# Altium project ECE453-Base.PrjPcb
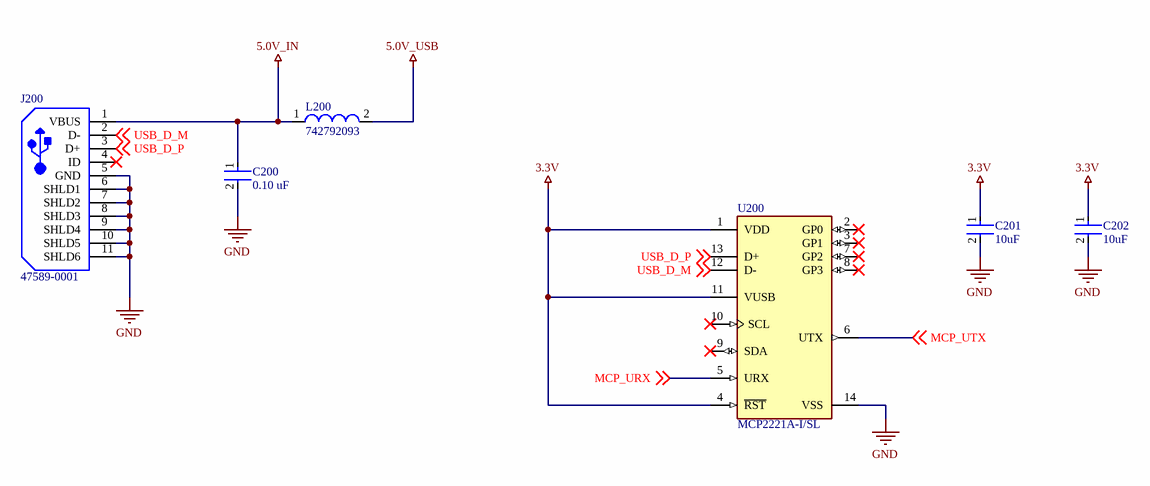
[diagram p0: 02_USB_Bridge.SchDoc]
5 sheets, 59 parts. Net scope: global (net labels, ports and power ports of the same name join across sheets).
Board file: ECE453.PcbDoc
Sheets:
  02_USB_Bridge.SchDoc
  03_Connectors.SchDoc
  05_Mechanical.SchDoc
  07_Programming_Reset.SchDoc
  08_User_IO.SchDoc

## Sheet 02_USB_Bridge.SchDoc: USB Bridge
size A; Revision: A; SheetNumber: 2; SheetTotal: 8; ECE315_Project_Name: ECE453 MCU Base Project

### Parts
C200  0.10 uF  [FP-C0805C-DN-MFG]
C201  10uF  [FP-C0805C-DG-MFG]
C202  10uF  [FP-C0805C-DG-MFG]
J200  47589-0001  [MOLX-47589-0001_V]
L200  742792093  [SMD-0805]
U200  MCP2221A-I/SL  [FP-C04-065-SL-MFG]

### Nets
3.3V: C201.1 C202.1 U200.1(VDD) U200.4(~{RST}) U200.11(VUSB)
5.0V_IN: C200.1 J200.1(VBUS) L200.1
5.0V_USB: L200.2
GND: C200.2 C201.2 C202.2 J200.5(GND) J200.6(SHLD1) J200.7(SHLD2) J200.8(SHLD3) J200.9(SHLD4) J200.10(SHLD5) J200.11(SHLD6) U200.14(VSS)
MCP_URX: U200.5(URX) ; off-sheet MCP_URX
MCP_UTX: U200.6(UTX) ; off-sheet MCP_UTX
USB_D_M: J200.2(D-) U200.12(D-) ; off-sheet USB_D_M
USB_D_P: J200.3(D+) U200.13(D+) ; off-sheet USB_D_P

Not connected (* = marked no-connect by the designer): J200 4(ID)*; U200 2(GP0)* 3(GP1)* 7(GP2)* 8(GP3)* 9(SDA)* 10(SCL)*

### Notes on the sheet
- Title:
- Size:
- A
- Project
- Rev:
- Sheet:
- of
- College of Engineering
- 1415 Engineering Drive
- Madison, WI 53706

### Library data of the parts
C200 = CMP-2007-00279-2: CAP CER 0.1UF 50V X7R 0805; Manufacturer Part Number: C0805C104K5RACTU; Manufacturer: KEMET; Value: 0.10 μF; Tolerance: 0.1; Temperature Coefficient: 30ppm/°C; Material: Ceramic; Device Class L2: Capacitors; Temperature Range Low: -55°C; Voltage Rating: 50 V; Digikey Description: CAP CER 0.1UF 50V X7R 0805; Category: Cap; ComponentLink2Description: Datasheet; Octopart: https://octopart.com/c0805c104k5ractu-kemet-143926; RoHS: TRUE; ComponentLink2URL: https://content.kemet.com/datasheets/KEM_C1003_C0G_SMD.pdf; Temperature Characteristic: X7R; Temperature: -55°C to +125°C; Height: 0.88mm; Temperature Range High: +125°C; Device Class L1: Passive Components; Automotive: No; Lead Free: Yes; Ipc Land Pattern Name: CAPC200125X78; Device Class L3: Ceramic Capacitors; Mouser Description: Cap Ceramic 0.1uF 50V X7R 10% SMD 2.0 x 1.2 mm 125 C Paper T/R; Capacitance: 0.10 μF; Package: C0805C-DN
C201 C202 = CMP-2007-03243-2: CAP CER 10UF 10V X5R 0805; Manufacturer Part Number: C0805C106K8PACTU; Manufacturer: Kemet; 3DS Part Number: 220-00001; Tolerance: 10%; Temperature Coefficient: 15%; Material: Ceramic; Device Class L2: Capacitors; Device Class L1: Passive Components; ComponentLink2URL: https://content.kemet.com/datasheets/KEM_C1006_X5R_SMD.pdf; Height: 1.4mm; Lead Free: Yes; Digikey Description: CAP CER 10UF 10V X5R 0805; Octopart: https://octopart.com/c0805c106k8pactu-kemet-98697; Capacitance: 10uF; Value: 10uF; Temperature Range Low: -55°C; Temperature: -55°C to +85°C; Automotive: No; Mouser Description: CAP CER 10UF 10V X5R 0805; Ipc Land Pattern Name: CAPC200125X125; Temperature Range High: +85°C; Voltage: 10V; RoHS: TRUE; Device Class L3: Ceramic Capacitors; ComponentLink2Description: Datasheet; Voltage Rating: 10V; Package: C0805C-DG; Temperature Characteristic: X5R; Category: Cap
J200 = CMP-2000-05610-1: Right Angle Female Type AB Micro USB Connector, 30 V, 1.8 A, -30 to 85 degC, RoHS, Tape and Reel; Number of Ports: 1Port; Current Rating: 1.8A; Brand: Molex; Connector Type: MicroUSBTypeABreceptacle; Number of Contacts: 5Contact; Voltage Rating: 30VAC; Color: Black; Product: MicroUSBTypeABConnectors; Package URL: http://www.molex.com/pdm_docs/sd/475890001_sd.pdf; Contact Plating: Gold; Datasheet URL: http://www.molex.com/webdocs/datasheets/pdf/en-us/0475890001_IO_CONNECTORS.pdf; Operating Temperature Range: -20Cto+85C; Termination Style: SMD/SMT; Mounting Angle: Right; Package Reference: 47589-0001; Gender: Female; Package Description: Micro USB Connector, Pitch 0.65 mm, 5 Positions, Body 7.5 x 5.6 mm; Mounting Technology: SurfaceMount; Contact Material: CopperAlloy; Packaging: Reel; RoHS: True; Standard: USB; Manufacturer URL: http://www.molex.com/; Manufacturer: Molex; Datasheet Version: 12/2016; Product Category: USBConnectors; Series: 47589
L200 = CMP-0220-00169-1: SMD EMI Suppression Ferrite Bead WE-CBF, Z = 2200 Ohm; DatasheetVersion: Dec-2005; ComponentLink2URL: http://www.we-online.de/katalog/media/pdf/742792093.pdf; PackageDescription: Chip Inductor, 2-Leads, Body 2.0 x 1.2 mm; Impedance: 2200 Ohm; ComponentLink2Description: Datasheet; ComponentLink1Description: Manufacturer Link; PackageReference: SMD-0805; ComponentLink1URL: http://www.we-online.com; PackageVersion: 2005
U200 = CMP-06284-000011-1: IC USB TO I2C/UART 14SOIC; Manufacturer: Microchip; Min Supply Voltage: 3V; Usb Standard: USB 2.0; Max Supply Voltage: 5.5V; Nominal Supply Current: 10-13mA; Automotive Grade: Grade 3; Interface: I2C,UART,USB; Standoff Height: 0.1mm; Max Junction Temp: +150°C; Data Rate: 12Mbits/s; Lead Free: Yes; Height: 1.75mm; Octopart: https://octopart.com/mcp2221a-i%2Fsl-microchip-71704986; Package: C04-065-SL; Digikey Description: IC USB TO I2C/UART 14SOIC; Temperature Range Low: -40°C; Temperature: -40°C to +85°C; Category: IC; Temperature Range High: +85°C; Ambient Temperature Range Low: -40°C; Device Class L1: Integrated Circuits (ICs); Footprint Url: http://ww1.microchip.com/downloads/en/DeviceDoc/14L%20SOIC%203_90%20mm%20%28SL%29%20C04-00065d.pdf; Automotive: Yes; ComponentLink2URL: http://ww1.microchip.com/downloads/en/DeviceDoc/20005565B.pdf; Ambient Temperature Range High: +85°C; RoHS: TRUE; Device Class L3: USB Interface ICs; ComponentLink2Description: Datasheet; Device Class L2: Interface ICs; Manufacturer Part Number: MCP2221A-I/SL; Ipc Land Pattern Name: SOIC127P600X175-14

## Sheet 03_Connectors.SchDoc: Off Board Connectors
size A; Revision: A; SheetNumber: 3; SheetTotal: 8; ECE315_Project_Name: ECE453 MCU Base Project
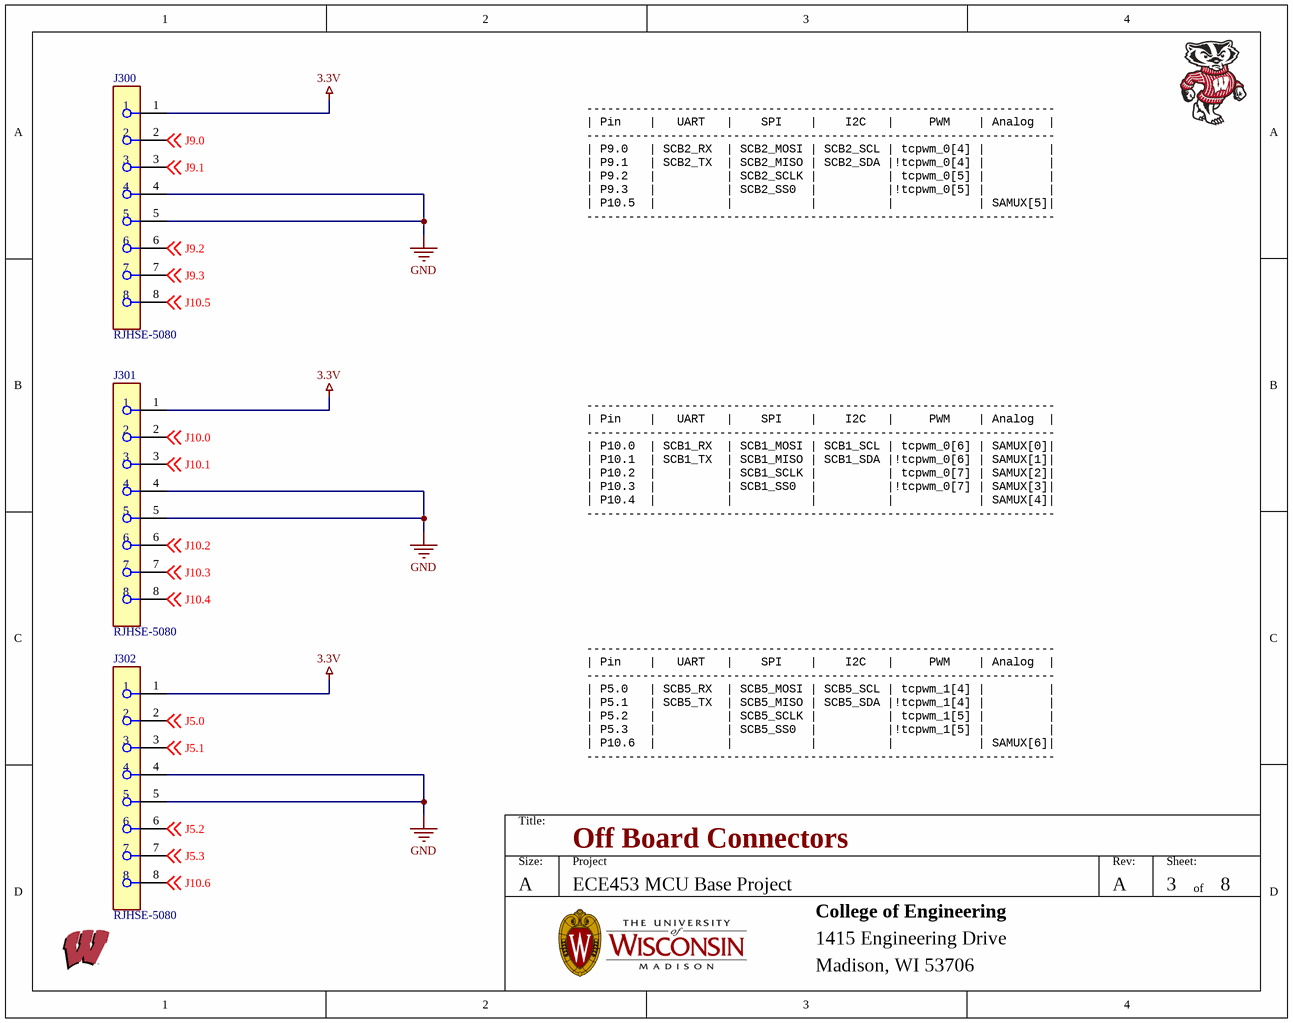
[diagram p1: 03_Connectors.SchDoc]

### Parts
J300  RJHSE-5080  [FP-RJHSE-5080-MFG]
J301  RJHSE-5080  [FP-RJHSE-5080-MFG]
J302  RJHSE-5080  [FP-RJHSE-5080-MFG]

### Nets
3.3V: J300.1 J301.1 J302.1
GND: J300.4 J300.5 J301.4 J301.5 J302.4 J302.5
J5.0: J302.2 ; off-sheet J5.0
J5.1: J302.3 ; off-sheet J5.1
J5.2: J302.6 ; off-sheet J5.2
J5.3: J302.7 ; off-sheet J5.3
J9.0: J300.2 ; off-sheet J9.0
J9.1: J300.3 ; off-sheet J9.1
J9.2: J300.6 ; off-sheet J9.2
J9.3: J300.7 ; off-sheet J9.3
J10.0: J301.2 ; off-sheet J10.0
J10.1: J301.3 ; off-sheet J10.1
J10.2: J301.6 ; off-sheet J10.2
J10.3: J301.7 ; off-sheet J10.3
J10.4: J301.8 ; off-sheet J10.4
J10.5: J300.8 ; off-sheet J10.5
J10.6: J302.8 ; off-sheet J10.6

### Notes on the sheet
- -------------------------------------------------------------------
  | Pin    |   UART   |    SPI    |    I2C   |     PWM    | Analog  |
  -------------------------------------------------------------------
  | P9.0   | SCB2_RX  | SCB2_MOSI | SCB2_SCL | tcpwm_0[4] |         |
  | P9.1   | SCB2_TX  | SCB2_MISO | SCB2_SDA |!tcpwm_0[4] |         |
  | P9.2   |          | SCB2_SCLK |          | tcpwm_0[5] |         |
  | P9.3   |          | SCB2_SS0  |          |!tcpwm_0[5] |         |
  | P10.5  |          |           |          |            | SAMUX[5]|
  -------------------------------------------------------------------
- -------------------------------------------------------------------
  | Pin    |   UART   |    SPI    |    I2C   |     PWM    | Analog  |
  -------------------------------------------------------------------
  | P10.0  | SCB1_RX  | SCB1_MOSI | SCB1_SCL | tcpwm_0[6] | SAMUX[0]|
  | P10.1  | SCB1_TX  | SCB1_MISO | SCB1_SDA |!tcpwm_0[6] | SAMUX[1]|
  | P10.2  |          | SCB1_SCLK |          | tcpwm_0[7] | SAMUX[2]|
  | P10.3  |          | SCB1_SS0  |          |!tcpwm_0[7] | SAMUX[3]|
  | P10.4  |          |           |          |            | SAMUX[4]|
  -------------------------------------------------------------------
- -------------------------------------------------------------------
  | Pin    |   UART   |    SPI    |    I2C   |     PWM    | Analog  |
  -------------------------------------------------------------------
  | P5.0   | SCB5_RX  | SCB5_MOSI | SCB5_SCL | tcpwm_1[4] |         |
  | P5.1   | SCB5_TX  | SCB5_MISO | SCB5_SDA |!tcpwm_1[4] |         |
  | P5.2   |          | SCB5_SCLK |          | tcpwm_1[5] |         |
  | P5.3   |          | SCB5_SS0  |          |!tcpwm_1[5] |         |
  | P10.6  |          |           |          |            | SAMUX[6]|
  -------------------------------------------------------------------
- Title:
- Size:
- A
- Project
- Rev:
- Sheet:
- of
- College of Engineering
- 1415 Engineering Drive
- Madison, WI 53706

### Library data of the parts
J300-J302 = CMP-02366-000003-1: CONN MOD JACK 8P8C R/A UNSHLD; Manufacturer: Amphenol; Current Rating: 1.5A; Voltage Rating: 125V; Pitch: 1.02mm; Conn Orientation: Right Angle; Number Of Contacts: 8; Is Female: yes; Conn Gender: Female; Contact Resistance: 20mR; Number of Ports: 1; Connector Type: RJ45; Lead Free: Yes; Device Class L3: unset; Footprint Url: https://cdn.amphenol-icc.com/media/wysiwyg/files/drawing/rjhse5080.pdf?__cf_chl_jschl_tk__=e349db0bbbb6188a39347cd5e541b92fa02c9719-1587748343-0-AW7tChdeHzRPLX9gSWj7WrKaXQoY9BsmT9Ek0h-T62M9y3Rs9iypFcOtkzb-6sGYQEjFE-jcoNciDETCOZrh1rYyOesac5SvYLoLwHIsHvF4AKBlx-MXmfZUVk9OTTJLqyQq2qMm0PFRLJpNcK0nrKResqOniRSYixG2sPTmOPraH-ULJFBDL602CHqcI9KKBgTq90Jh1OL2Td4moJ99rFsJRJ1Tk_uoxGe8ublcP_ARu-uLpWcQrBcwOcHDTAwL29DAwVaqcH7ta8Ks7WMlHmVl_pILeEDwT0bE9vu5Pa5S3PtNRF1leuFkgi_FMbUxTDulc5xzbXSfng8srUIV1lWXny5nx1fZJEUa_w97yKjffzBMxiWLWVN-V7-uqAaPbyv_m-wRyw5O25OZNyJOeGU; ComponentLink2URL: https://cdn.amphenol-icc.com/media/wysiwyg/files/documentation/datasheet/inputoutput/io-modjack-rjhse.pdf; Device Class L1: Connectors; Package: CONN_MOD_JACK; Mouser Description: Modular Connectors / Ethernet Connectors R/A RJ45 NONSHIELDED 8 CONT NO LEDS; Manufacturer Part Number: RJHSE-5080; Octopart: https://octopart.com/rjhse-5080-amphenol-45060; Category: Conn; Height: 0.535inch; Temperature: -55°C to +85°C; Digikey Description: CONN MOD JACK 8P8C R/A UNSHLD; Device Class L2: Modular / Ethernet Connectors; Contact Material: Gold,Nickel; ComponentLink2Description: Datasheet; Temperature Range Low: -55°C; RoHS: TRUE; Automotive: No; Temperature Range High: +85°C; Supplier: Digikey; Supplier Part Number: RJHSE-5080-ND; Stock: 72112; Pricing: 1=1.03, 10=0.867, 25=0.832, 50=0.8142, 100=0.7788, 250=0.708, 500=0.6372, 1000=0.56641, 2500=0.51331 (USD); Mounting Technology: Through Hole,Panel; Contact Plating: Gold; Max Current Rating: 1.5A; Number of Positions Loaded: 8; Max Voltage Rating (AC): 125V; Orientation: Right Angle; Packaging: Rail/Tube; Gender: Female; Termination: Solder; Number of Positions: 8; Voltage Rating (DC): 125V; Length: 15.75mm; Depth: 14.99mm; Radiation Hardening: No; RoHS Compliant: Yes; Reach SVHC Compliant: Unknown; ComponentLink1URL: https://datasheet.ciiva.com/7629/1682821-7629402.pdf?src-supplier=Element14; ComponentLink1Description: https://datasheet.ciiva.com/7629/1682821-7629402.pdf?src-supplier=Element14; ComponentLink3URL: https://datasheet.ciiva.com/1432/1693748-1432448.pdf?src-supplier=Element14; ComponentLink3Description: https://datasheet.ciiva.com/1432/1693748-1432448.pdf?src-supplier=Element14

## Sheet 05_Mechanical.SchDoc: Mechanicals
size A; Revision: A; SheetNumber: 5; SheetTotal: 8; ECE315_Project_Name: ECE453 MCU Base Project
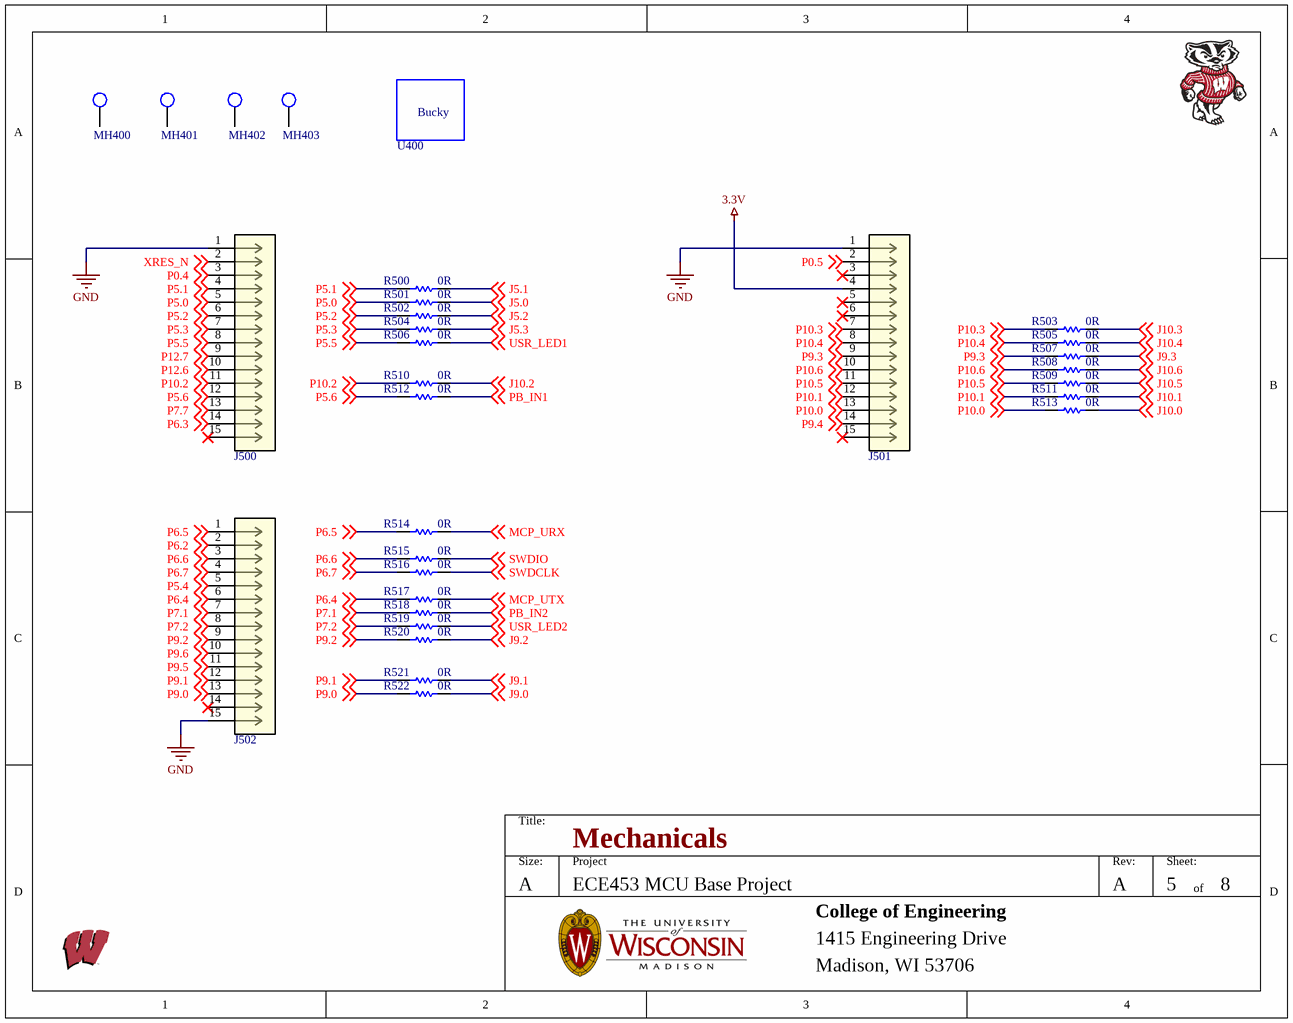
[diagram p2: 05_Mechanical.SchDoc]

### Parts
J500  68000-115HLF  [CONN_15POS_2P54MM]  (value not drawn)
J501  68000-115HLF  [CONN_15POS_2P54MM]  (value not drawn)
J502  68000-115HLF  [CONN_15POS_2P54MM]  (value not drawn)
MH400  MHOLE_2_55MM  [MHOLE_2_55MM]  (value not drawn)
MH401  MHOLE_2_55MM  [MHOLE_2_55MM]  (value not drawn)
MH402  MHOLE_2_55MM  [MHOLE_2_55MM]  (value not drawn)
MH403  MHOLE_2_55MM  [MHOLE_2_55MM]  (value not drawn)
R500  0R  [RESC2013X70X40NL20T20]
R501  0R  [RESC2013X70X40NL20T20]
R502  0R  [RESC2013X70X40NL20T20]
R503  0R  [RESC2013X70X40NL20T20]
R504  0R  [RESC2013X70X40NL20T20]
R505  0R  [RESC2013X70X40NL20T20]
R506  0R  [RESC2013X70X40NL20T20]
R507  0R  [RESC2013X70X40NL20T20]
R508  0R  [RESC2013X70X40NL20T20]
R509  0R  [RESC2013X70X40NL20T20]
R510  0R  [RESC2013X70X40NL20T20]
R511  0R  [RESC2013X70X40NL20T20]
R512  0R  [RESC2013X70X40NL20T20]
R513  0R  [RESC2013X70X40NL20T20]
R514  0R  [RESC2013X70X40NL20T20]
R515  0R  [RESC2013X70X40NL20T20]
R516  0R  [RESC2013X70X40NL20T20]
R517  0R  [RESC2013X70X40NL20T20]
R518  0R  [RESC2013X70X40NL20T20]
R519  0R  [RESC2013X70X40NL20T20]
R520  0R  [RESC2013X70X40NL20T20]
R521  0R  [RESC2013X70X40NL20T20]
R522  0R  [RESC2013X70X40NL20T20]
U400  Bucky  [WalkingBucky]  (value not drawn)  (no BOM)

### Nets
3.3V: J501.4
GND: J500.1 J501.1 J502.15
J5.0: R501.2 ; off-sheet J5.0
J5.1: R500.2 ; off-sheet J5.1
J5.2: R502.2 ; off-sheet J5.2
J5.3: R504.2 ; off-sheet J5.3
J9.0: R522.2 ; off-sheet J9.0
J9.1: R521.2 ; off-sheet J9.1
J9.2: R520.2 ; off-sheet J9.2
J9.3: R507.2 ; off-sheet J9.3
J10.0: R513.2 ; off-sheet J10.0
J10.1: R511.2 ; off-sheet J10.1
J10.2: R510.2 ; off-sheet J10.2
J10.3: R503.2 ; off-sheet J10.3
J10.4: R505.2 ; off-sheet J10.4
J10.5: R509.2 ; off-sheet J10.5
J10.6: R508.2 ; off-sheet J10.6
MCP_URX: R514.2 ; off-sheet MCP_URX
MCP_UTX: R517.2 ; off-sheet MCP_UTX
P0.4: J500.3 ; off-sheet P0.4
P0.5: J501.2 ; off-sheet P0.5
P5.0: J500.5 R501.1 ; off-sheet P5.0
P5.1: J500.4 R500.1 ; off-sheet P5.1
P5.2: J500.6 R502.1 ; off-sheet P5.2
P5.3: J500.7 R504.1 ; off-sheet P5.3
P5.4: J502.5 ; off-sheet P5.4
P5.5: J500.8 R506.1 ; off-sheet P5.5
P5.6: J500.12 R512.1 ; off-sheet P5.6
P6.2: J502.2 ; off-sheet P6.2
P6.3: J500.14 ; off-sheet P6.3
P6.4: J502.6 R517.1 ; off-sheet P6.4
P6.5: J502.1 R514.1 ; off-sheet P6.5
P6.6: J502.3 R515.1 ; off-sheet P6.6
P6.7: J502.4 R516.1 ; off-sheet P6.7
P7.1: J502.7 R518.1 ; off-sheet P7.1
P7.2: J502.8 R519.1 ; off-sheet P7.2
P7.7: J500.13 ; off-sheet P7.7
P9.0: J502.13 R522.1 ; off-sheet P9.0
P9.1: J502.12 R521.1 ; off-sheet P9.1
P9.2: J502.9 R520.1 ; off-sheet P9.2
P9.3: J501.9 R507.1 ; off-sheet P9.3
P9.4: J501.14 ; off-sheet P9.4
P9.5: J502.11 ; off-sheet P9.5
P9.6: J502.10 ; off-sheet P9.6
P10.0: J501.13 R513.1 ; off-sheet P10.0
P10.1: J501.12 R511.1 ; off-sheet P10.1
P10.2: J500.11 R510.1 ; off-sheet P10.2
P10.3: J501.7 R503.1 ; off-sheet P10.3
P10.4: J501.8 R505.1 ; off-sheet P10.4
P10.5: J501.11 R509.1 ; off-sheet P10.5
P10.6: J501.10 R508.1 ; off-sheet P10.6
P12.6: J500.10 ; off-sheet P12.6
P12.7: J500.9 ; off-sheet P12.7
PB_IN1: R512.2 ; off-sheet PB_IN1
PB_IN2: R518.2 ; off-sheet PB_IN2
SWDCLK: R516.2 ; off-sheet SWDCLK
SWDIO: R515.2 ; off-sheet SWDIO
USR_LED1: R506.2 ; off-sheet USR_LED1
USR_LED2: R519.2 ; off-sheet USR_LED2
XRES_N: J500.2 ; off-sheet XRES_N

Not connected (* = marked no-connect by the designer): J500 15*; J501 3* 5* 6* 15*; J502 14*; MH400 1; MH401 1; MH402 1; MH403 1

### Notes on the sheet
- Title:
- Size:
- A
- Project
- Rev:
- Sheet:
- of
- College of Engineering
- 1415 Engineering Drive
- Madison, WI 53706

### Library data of the parts
J500-J502 = CONN_HEADER_POS_30_2.54MM: Conn Unshrouded Header HDR 15 POS 2.54mm Solder ST Thru-Hole; Mfr_Name: Amphenol ICC; Manufacturer: Adam Equipment; Manufacturer Part Number: PH1-15-UA; Copyright: Copyright (C) 2024 Ultra Librarian. All rights reserved.; Manufacturer_Part_Number: 68000-115HLF; RefDes: RefDes; Type: DEV; Supplier: Digikey; Supplier Part Number: 2057-PH1-15-UA-ND; RoHS: No; Category: Connectors; Stock: 2835; Pricing: 1=0.18, 10=0.15, 100=0.1157, 500=0.09788, 1000=0.08008, 5000=0.07118, 10000=0.06451 (USD)
MH400-MH403 = MHOLE_2_55MM: Mounting Holde; Manufacturer Part Number: UW MTHOLE
R500-R522 = CMP-1665-00002-5: Chip Resistor, 0 Ohm, +/- 1%, 0.125 W, -55 to 155 degC, 0805 (2012 Metric), RoHS, Tape and Reel; PartNumber: ERJ-6GEY0R00V; Tolerance: 5%; Resistance: 0 Ohm; REACH SVHC: No SVHC; Min Operating Temperature: -55 degC; Case/Package: 0805; Packaging: Tape and Reel; Package Quantity: 5000; ComponentLink1Description: Manufacturer URL; PackageDescription: 2-Pin Surface Mount Device, Body 2 x 1.25 mm; Mounting Technology: Surface Mount; Max Operating Temperature: 155 degC; Width: 1.25 mm; RoHSCompliant: True; Height: 0.6 mm; ComponentLink1URL: http://www.panasonic.com/; ComponentLink2URL: http://industrial.panasonic.com/cdbs/www-data/pdf/RDA0000/AOA0000C84.pdf; Case Code (Imperial): 0805; DatasheetVersion: 03/2015; Length: 2 mm; Case Code (Metric): 2012; ComponentLink2Description: Datasheet; Radiation Hardening: No
U400 = Bucky: Bucky Badger Image; Manufacturer Part Number: UW Bucky

## Sheet 07_Programming_Reset.SchDoc: Programming / Reset
size A; Revision: A; SheetNumber: 7; SheetTotal: 8; ECE315_Project_Name: ECE453 MCU Base Project
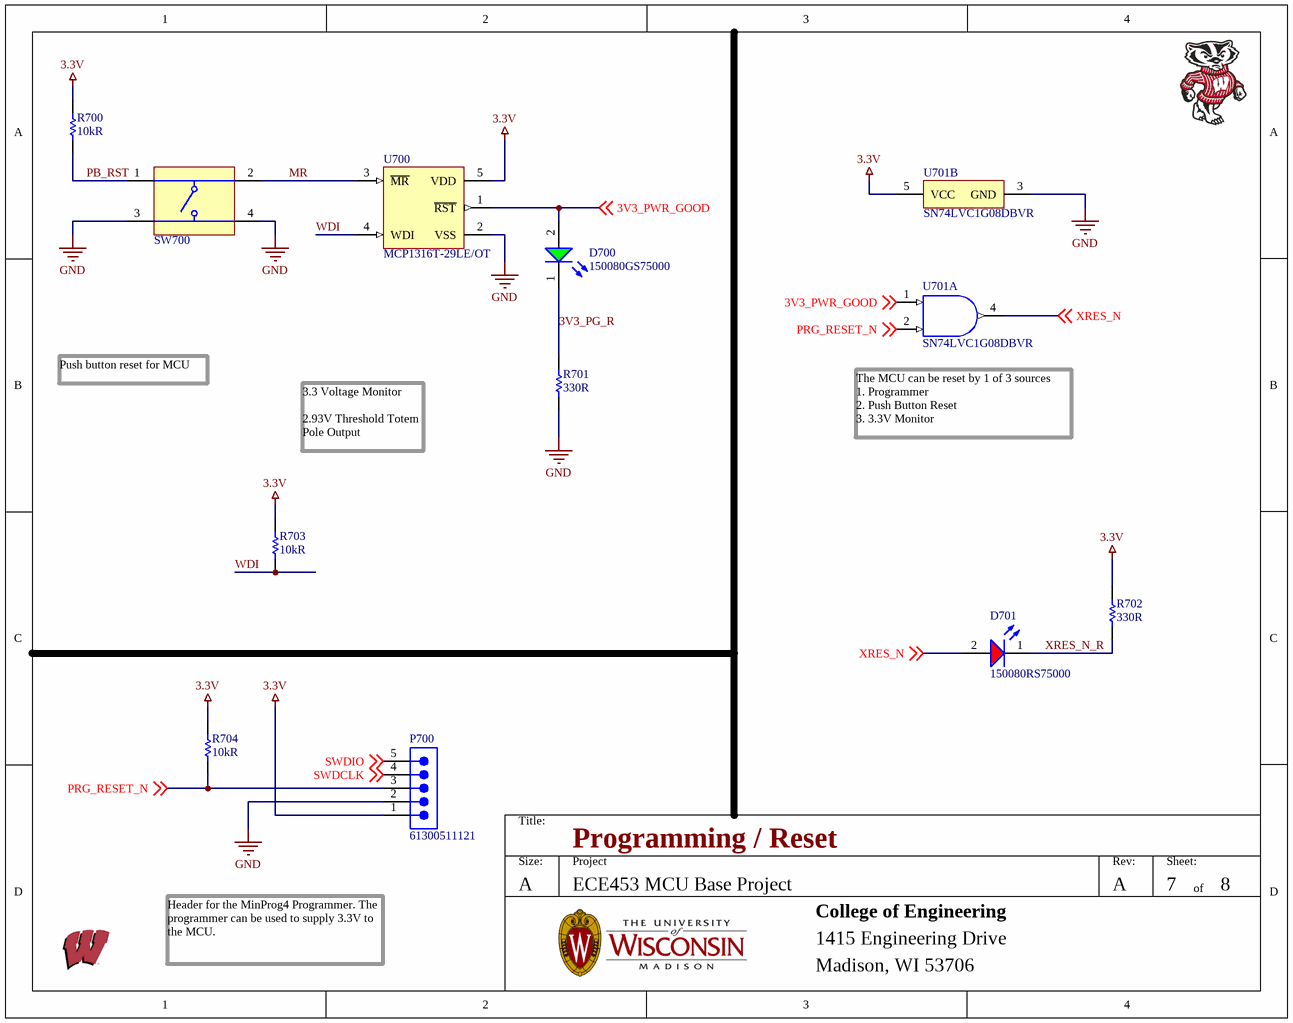
[diagram p3: 07_Programming_Reset.SchDoc]

### Parts
D700  150080GS75000  [WL-SMCW_0805_150080xx75000]
D701  150080RS75000  [WL-SMCW_0805_150080xx75000]
P700  61300511121  [61300511121]
R700  10kR  [RESC2013X70X40ML20T20]
R701  330R  [RESC2013X60X40LL20T25]
R702  330R  [RESC2013X60X40LL20T25]
R703  10kR  [RESC2013X70X40ML20T20]
R704  10kR  [RESC2013X70X40ML20T20]
SW700  (no value)  [TECO-FSM4JSMA_V]
U700  MCP1316T-29LE/OT  [SOT-23-OT5_M]
U701  SN74LVC1G08DBVR  [DBV0005A_M]  (parts A,B of 2)

### Nets
3.3V: P700.1 R700.2 R702.1 R703.2 R704.2 U700.5(VDD) U701.5(VCC)
GND: P700.2 R701.2 SW700.3 SW700.4 U700.2(VSS) U701.3(GND)
3V3_PG_R: D700.1(K) R701.1
3V3_PWR_GOOD: D700.2(A) U700.1(~{RST}) U701.1(A) ; off-sheet 3V3_PWR_GOOD
MR: SW700.2 U700.3(~{MR})
PB_RST: R700.1 SW700.1
PRG_RESET_N: P700.3 R704.1 U701.2(B) ; off-sheet PRG_RESET_N
SWDCLK: P700.4 ; off-sheet SWDCLK
SWDIO: P700.5 ; off-sheet SWDIO
WDI: R703.1 U700.4(WDI)
XRES_N: D701.2(A) U701.4(Y) ; off-sheet XRES_N
XRES_N_R: D701.1(K) R702.2

### Notes on the sheet
- Push button reset for MCU
- (near U701) The MCU can be reset by 1 of 3 sources
  1. Programmer
  2. Push Button Reset
  3. 3.3V Monitor
- 3.3 Voltage Monitor
  2.93V Threshold Totem Pole Output
- Header for the MinProg4 Programmer. The programmer can be used to supply 3.3V to the MCU.
- Title:
- Size:
- A
- Project
- Rev:
- Sheet:
- of
- College of Engineering
- 1415 Engineering Drive
- Madison, WI 53706

### Library data of the parts
D700 = CMP-1426-00007-2: NexarPartId: 29717780; Wavelength: 520nm; Forward Current: 100mA; Lens Style: Clear, Rectangular; Dominant Wavelength: 525nm; Max Junction Temperature (Tj): 95°C; Power Dissipation: 105mW; Luminous Intensity: 450mcd; Peak Wavelength: 515nm; Color: Green; Viewing Angle: 140°; Test Current: 20mA; Reverse Voltage: 5V; Forward Voltage: 3.2V; Mount: Surface Mount; REACH SVHC: Unknown; Min Operating Temperature: -40°C; Case Code (Imperial): 0805; Case/Package: 0805; Max Operating Temperature: 85°C; RoHS: Compliant; Length: 2mm; Height: 700µm; Width: 1.25mm; Case Code (Metric): 2012; Packaging: Tape and Reel; Max Reverse Voltage (DC): 5V
D701 = CMP-1426-00011-2: NexarPartId: 29717781; Peak Wavelength: 630nm; Wavelength: 625nm; Viewing Angle: 140°; Test Current: 20mA; Forward Voltage: 2V; Forward Current: 100mA; Lens Style: Clear, Rectangular; Color: Red; Luminous Intensity: 150mcd; Max Reverse Voltage (DC): 5V; Length: 2mm; Case Code (Imperial): 0805; RoHS: Compliant; Max Operating Temperature: 85°C; Height: 700µm; Packaging: Tape and Reel; Case/Package: 0805; REACH SVHC: Unknown; Dominant Wavelength: 625nm; Min Operating Temperature: -40°C; Case Code (Metric): 2012; Mount: Surface Mount; Width: 1.25mm
P700 = CMP-1502-01068-2: NexarPartId: 32855526; Operating Supply Voltage: 250V; Number of Contacts: 5; Connector Type: Male Pin; Current Rating: 3A; Contact Resistance: 20mΩ; Pitch: 2.54mm; Gender: Male; Termination: Solder; RoHS: Compliant; Lead Pitch: 2.54mm; Contact Mating Length: 5.9944mm; Number of Positions: 5; Lead Free: Lead Free; Contact Plating: Gold; Number of Pins: 5; Min Operating Temperature: -40°C; Voltage Rating: 250V; Color: Black; Mount: Through Hole; REACH SVHC: Unknown; Packaging: Bulk; Height: 8.89mm; Number of Rows: 1; Orientation: Vertical; Contact Material: Copper; Max Operating Temperature: 105°C
R700 R703 R704 = CMP-2001-04376-1: Manufacturer: Panasonic; Part Number: ERJ-6ENF1002V
R701 R702 = CMP-2001-00628-1: Manufacturer: Panasonic; Part Number: ERA6AEB331V
SW700 = CMP-2000-05602-2: Swicth, SPST, 24 V, -35 to 85 degC, 4-Pin SMD, RoHS, Tape and Reel; Manufacturer: TE Connectivity; Switch Travel: 0.25mm; Mechanical Life: 100000Cycles; Contact Current Rating: 50mA; Operating Force: 1.57N; Actuator Material: Polyamide; Contact Resistance: 100mOhm; Voltage Rating: 24V; Illumination Type: Illuminated; Actuator Length: 0.055inch; Max Voltage Rating (DC): 12V; Case\/Package: SMD/SMT; Orientation: Straight; Datasheet URL: http://www.te.com/commerce/DocumentDelivery/DDEController?Action=showdoc&DocId=Customer+Drawing%7F2-1437565-7%7FV%7Fpdf%7FEnglish%7FENG_CD_2-1437565-7_V.pdf%7F4-1437565-2; Min Operating Temperature: -35degC; Packaging: LoosePiece; Termination: GullWing; Throw Configuration: SPST; Package Description: 4-Pin Surface Mount Device, Body 6 x 6 mm, Pitch 4.5 mm; Mounting Technology: SurfaceMount; Contact Plating: Silver; Datasheet Version: Rev. V, 02/2015; RoHSCompliant: true; Max Operating Temperature: 85degC; Length: 6mm; Voltage Rating (DC): 24V; Electrical Life: 100000Cycles; Current Rating: 50mA; Package Quantity: 750; Mount: SurfaceMount; Package Reference: FSM4JSMA; Manufacturer URL: http://www.te.com/; Width: 6mm; REACH SVHC: Unknown; Contact Material: CopperAlloy
U700 = CMP-0138-00207-1: Voltage Supervisor, 5-Pin SOT-23, Extended Temperature, Tape and Reel; PackageReference: SOT-23-OT5; Code_IPC: SOT23-5; DatasheetVersion: revB, Oct-2007; PackageDescription: 5-Lead Plastic Small Outline Transistor (OT) [SOT-23]; PackageVersion: revBB, Aug-2009
U701 = CMP-0859-00053-3: Single 2-Input Positive-AND Gate, DBV0005A, LARGE T&R; Manufacturer: Texas Instruments; Logic: True; ICC @ Nom Voltage(Max)(mA): 0.01; VCC(Min)(V): 1.65; Bits(#): 1; Rating: Catalog; Schmitt Trigger: No; Voltage(Nom)(V): 1.8,2.5,3.3,5; Output Drive (IOL/IOH)(Max)(mA): 32/-32; Gate Type: AND; tpd @ Nom Voltage(Max)(ns): 4.5,6,4,5; VCC(Max)(V): 5.5; Output Type: CMOS; F @ Nom Voltage(Max)(Mhz): 150; Input Type: CMOS/TTL; Technology Family: LVC; Sub-Family: AND Gate; PackageReference: DBV0005A; Generic Part Number: SN74LVC1G08; Operating Temperature Range(C): -40 to 125,-40 to 85; 3-State Output: No; DatasheetVersion: SCES217Y

## Sheet 08_User_IO.SchDoc: User IO
size A; Revision: A; SheetNumber: 8; SheetTotal: 8; ECE315_Project_Name: ECE453 MCU Base Project
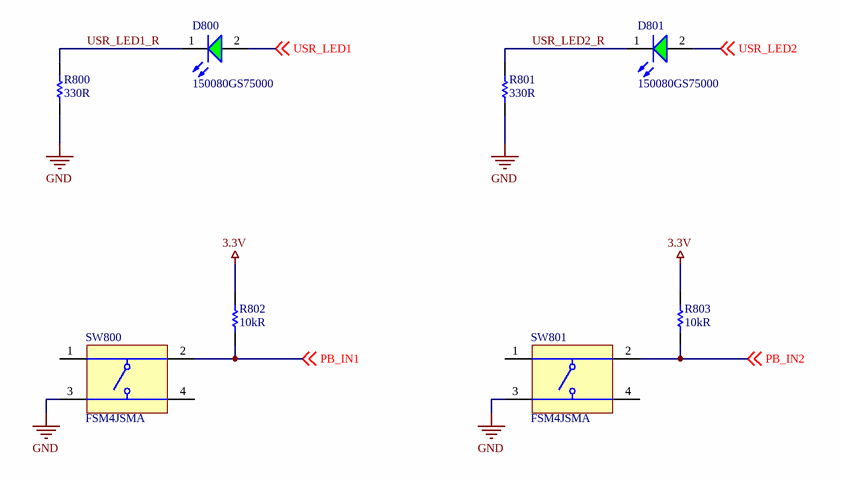
[diagram p4: 08_User_IO.SchDoc]

### Parts
D800  150080GS75000  [WL-SMCW_0805_150080xx75000]
D801  150080GS75000  [WL-SMCW_0805_150080xx75000]
R800  330R  [RESC2013X60X40LL20T25]
R801  330R  [RESC2013X60X40LL20T25]
R802  10kR  [RESC2013X70X40ML20T20]
R803  10kR  [RESC2013X70X40ML20T20]
SW800  FSM4JSMA  [TECO-FSM4JSMA_V]
SW801  FSM4JSMA  [TECO-FSM4JSMA_V]

### Nets
3.3V: R802.2 R803.2
GND: R800.2 R801.2 SW800.3 SW801.3
PB_IN1: R802.1 SW800.2 ; off-sheet PB_IN1
PB_IN2: R803.1 SW801.2 ; off-sheet PB_IN2
USR_LED1: D800.2(A) ; off-sheet USR_LED1
USR_LED1_R: D800.1(K) R800.1
USR_LED2: D801.2(A) ; off-sheet USR_LED2
USR_LED2_R: D801.1(K) R801.1

Not connected (* = marked no-connect by the designer): SW800 1 4; SW801 1 4

### Notes on the sheet
- Title:
- Size:
- A
- Project
- Rev:
- Sheet:
- of
- College of Engineering
- 1415 Engineering Drive
- Madison, WI 53706

### Library data of the parts
D800 D801 = CMP-1426-00007-2: as D700 on sheet 07_Programming_Reset; Mount: Surface Mount; REACH SVHC: Unknown; Min Operating Temperature: -40°C; Case Code (Imperial): 0805; Case/Package: 0805; Max Operating Temperature: 85°C; RoHS: Compliant; Length: 2mm; Height: 700µm; Width: 1.25mm; Case Code (Metric): 2012; Packaging: Tape and Reel; Max Reverse Voltage (DC): 5V
R800 R801 = CMP-2001-00628-1: as R701 on sheet 07_Programming_Reset
R802 R803 = CMP-2001-04376-1: as R700 on sheet 07_Programming_Reset
SW800 SW801 = CMP-2000-05602-2: as SW700 on sheet 07_Programming_Reset; Orientation: Straight; Datasheet URL: http://www.te.com/commerce/DocumentDelivery/DDEController?Action=showdoc&DocId=Customer+Drawing%7F2-1437565-7%7FV%7Fpdf%7FEnglish%7FENG_CD_2-1437565-7_V.pdf%7F4-1437565-2; Min Operating Temperature: -35degC; Packaging: LoosePiece; Termination: GullWing; Throw Configuration: SPST; Package Description: 4-Pin Surface Mount Device, Body 6 x 6 mm, Pitch 4.5 mm; Mounting Technology: SurfaceMount; Contact Plating: Silver; Datasheet Version: Rev. V, 02/2015; RoHSCompliant: true; Max Operating Temperature: 85degC; Length: 6mm; Voltage Rating (DC): 24V; Electrical Life: 100000Cycles; Current Rating: 50mA; Package Quantity: 750; Mount: SurfaceMount; Package Reference: FSM4JSMA; Manufacturer URL: http://www.te.com/; Width: 6mm; REACH SVHC: Unknown; Contact Material: CopperAlloy

## Nets that join several sheets
3.3V: 02_USB_Bridge (5 pins), 03_Connectors (J300.1 J301.1 J302.1), 05_Mechanical (J501.4), 07_Programming_Reset (7 pins), 08_User_IO (R802.2 R803.2)
GND: 02_USB_Bridge (11 pins), 03_Connectors (6 pins), 05_Mechanical (J500.1 J501.1 J502.15), 07_Programming_Reset (6 pins), 08_User_IO (R800.2 R801.2 SW800.3 SW801.3)
J5.0: 03_Connectors (J302.2), 05_Mechanical (R501.2)
J5.1: 03_Connectors (J302.3), 05_Mechanical (R500.2)
J5.2: 03_Connectors (J302.6), 05_Mechanical (R502.2)
J5.3: 03_Connectors (J302.7), 05_Mechanical (R504.2)
J9.0: 03_Connectors (J300.2), 05_Mechanical (R522.2)
J9.1: 03_Connectors (J300.3), 05_Mechanical (R521.2)
J9.2: 03_Connectors (J300.6), 05_Mechanical (R520.2)
J9.3: 03_Connectors (J300.7), 05_Mechanical (R507.2)
J10.0: 03_Connectors (J301.2), 05_Mechanical (R513.2)
J10.1: 03_Connectors (J301.3), 05_Mechanical (R511.2)
J10.2: 03_Connectors (J301.6), 05_Mechanical (R510.2)
J10.3: 03_Connectors (J301.7), 05_Mechanical (R503.2)
J10.4: 03_Connectors (J301.8), 05_Mechanical (R505.2)
J10.5: 03_Connectors (J300.8), 05_Mechanical (R509.2)
J10.6: 03_Connectors (J302.8), 05_Mechanical (R508.2)
MCP_URX: 02_USB_Bridge (U200.5), 05_Mechanical (R514.2)
MCP_UTX: 02_USB_Bridge (U200.6), 05_Mechanical (R517.2)
PB_IN1: 05_Mechanical (R512.2), 08_User_IO (R802.1 SW800.2)
PB_IN2: 05_Mechanical (R518.2), 08_User_IO (R803.1 SW801.2)
SWDCLK: 05_Mechanical (R516.2), 07_Programming_Reset (P700.4)
SWDIO: 05_Mechanical (R515.2), 07_Programming_Reset (P700.5)
USR_LED1: 05_Mechanical (R506.2), 08_User_IO (D800.2)
USR_LED2: 05_Mechanical (R519.2), 08_User_IO (D801.2)
XRES_N: 05_Mechanical (J500.2), 07_Programming_Reset (D701.2 U701.4)